# EAGLE schematic Flasher (EAGLE 7.6.0)
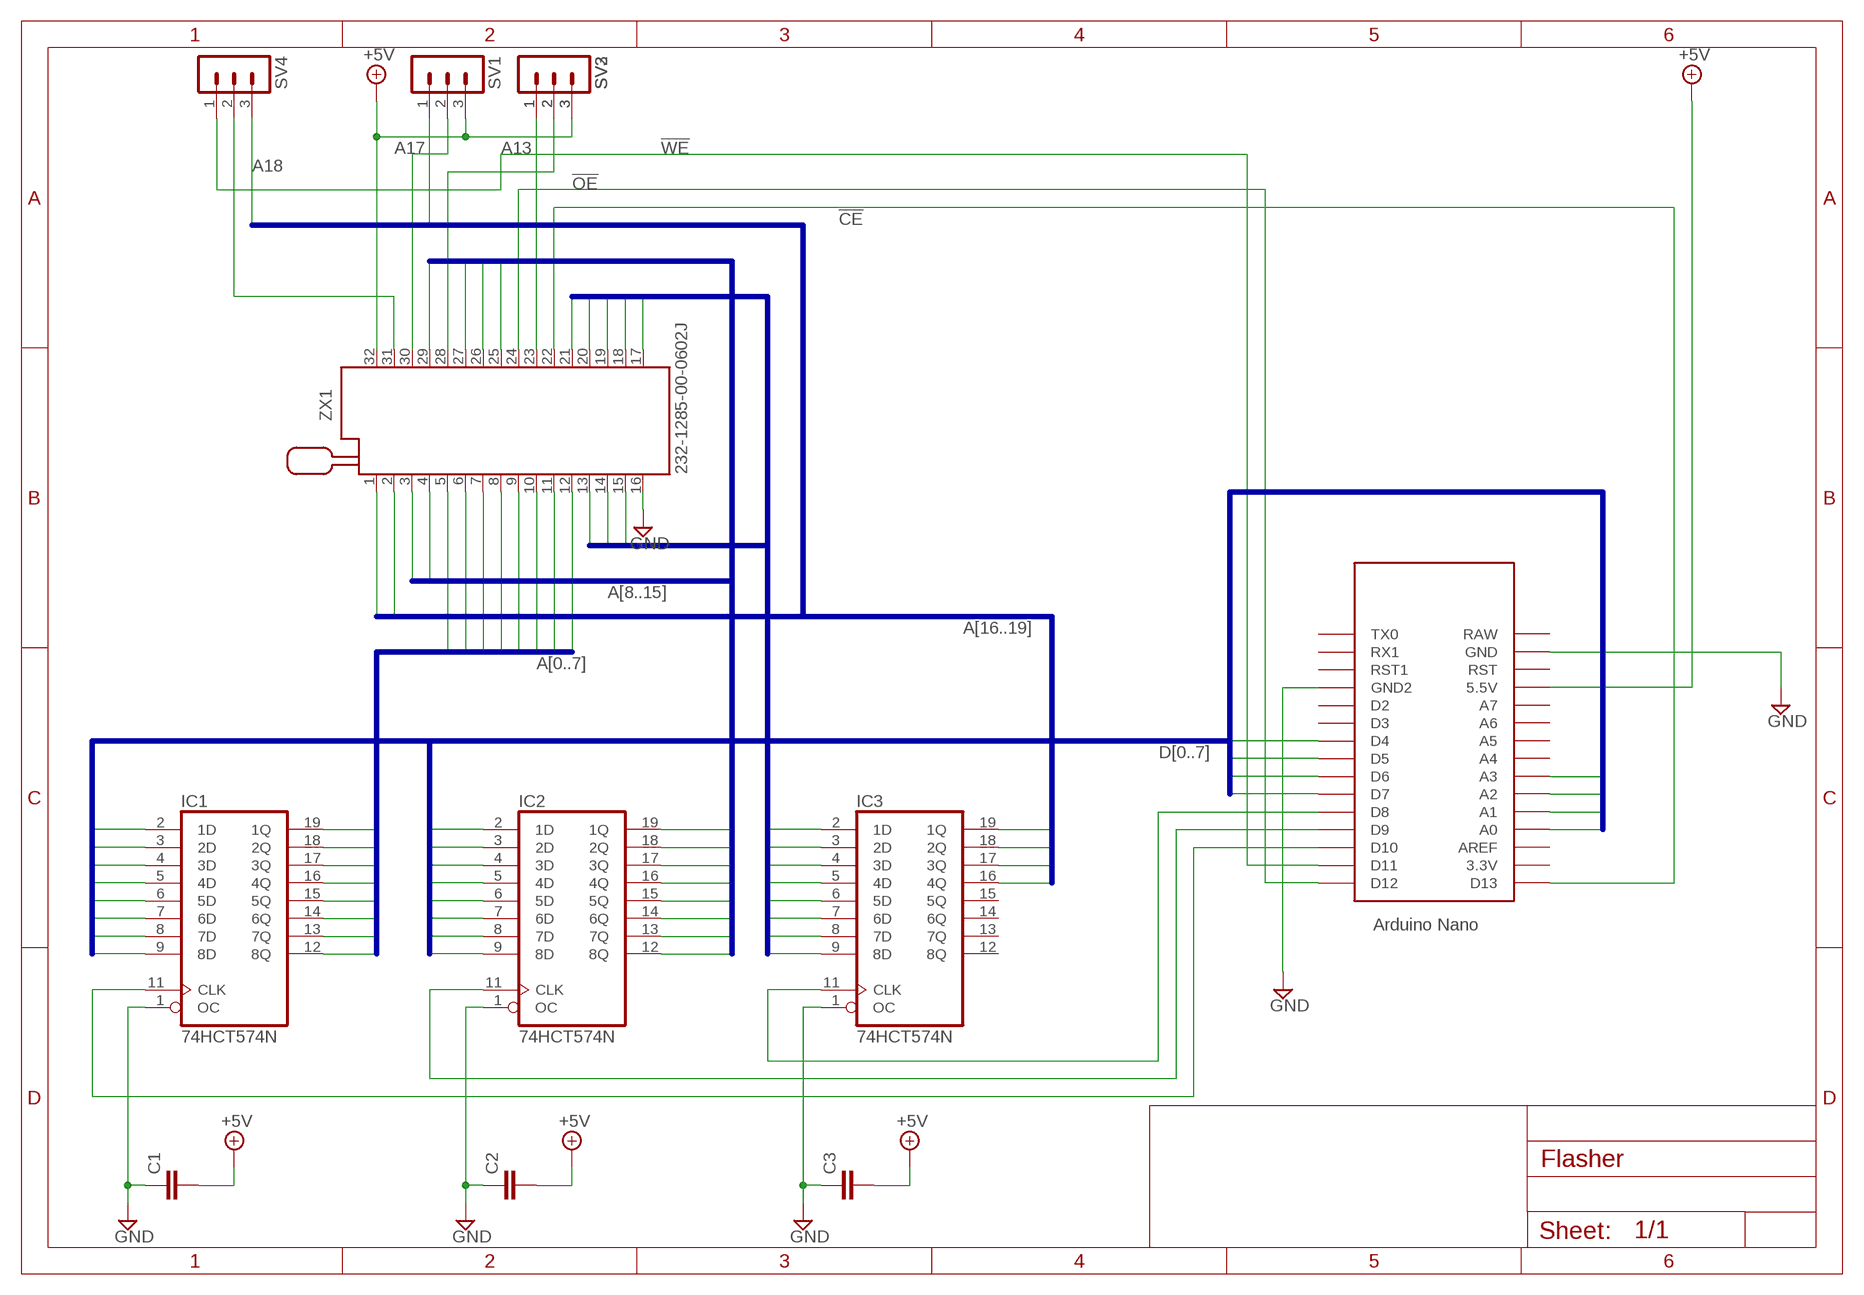
[diagram p0: schematic, sheet 1]

## Parts
C1  C-EU025-024X044  [C025-024X044]
C2  C-EU025-024X044  [C025-024X044]
C3  C-EU025-024X044  [C025-024X044]
IC1  74HCT574N  [DIL20]
IC2  74HCT574N  [DIL20]
IC3  74HCT574N  [DIL20]
SV1  MA03-1  [MA03-1]
SV2  MA03-1  [MA03-1]
SV3  MA03-1  [MA03-1]
SV4  MA03-1  [MA03-1]
U$1  NANO  [NANO]
ZX1  232-1285-00-0602J  [232-1285-00-0602J]

## Nets
!CE: U$1.D13 ZX1.22
!OE: U$1.D12 ZX1.24
!WE: SV4.1 U$1.D11
+5V: C1.2 C2.2 C3.2 SV1.3 SV2.3 SV3.3 U$1.5V(5.5V) ZX1.32
A0: IC1.19(1Q) ZX1.12
A1: IC1.18(2Q) ZX1.11
A2: IC1.17(3Q) ZX1.10
A3: IC1.16(4Q) ZX1.9
A4: IC1.15(5Q) ZX1.8
A5: IC1.14(6Q) ZX1.7
A6: IC1.13(7Q) ZX1.6
A7: IC1.12(8Q) ZX1.5
A8: IC2.19(1Q) ZX1.27
A9: IC2.18(2Q) ZX1.26
A10: IC2.17(3Q) ZX1.23
A11: IC2.16(4Q) ZX1.25
A12: IC2.15(5Q) ZX1.4
A13: IC2.14(6Q) SV2.1 SV3.1
A14: IC2.13(7Q) ZX1.29
A15: IC2.12(8Q) ZX1.3
A16: IC3.19(1Q) ZX1.2
A17: IC3.18(2Q) SV1.1
A18: IC3.17(3Q) SV4.3
A19: IC3.16(4Q) ZX1.1
D0: IC1.2(1D) IC2.2(1D) IC3.2(1D) U$1.A0 ZX1.13
D1: IC1.3(2D) IC2.3(2D) IC3.3(2D) U$1.A1 ZX1.14
D2: IC1.4(3D) IC2.4(3D) IC3.4(3D) U$1.A2 ZX1.15
D3: IC1.5(4D) IC2.5(4D) IC3.5(4D) U$1.A3 ZX1.17
D4: IC1.6(5D) IC2.6(5D) IC3.6(5D) U$1.D4 ZX1.18
D5: IC1.7(6D) IC2.7(6D) IC3.7(6D) U$1.D5 ZX1.19
D6: IC1.8(7D) IC2.8(7D) IC3.8(7D) U$1.D6 ZX1.20
D7: IC1.9(8D) IC2.9(8D) IC3.9(8D) U$1.D7 ZX1.21
GND: C1.1 C2.1 C3.1 IC1.1(OC) IC2.1(OC) IC3.1(OC) U$1.GND U$1.GND1(GND2) ZX1.16
N$1: IC1.11(CLK) U$1.D10
N$2: IC2.11(CLK) U$1.D9
N$3: IC3.11(CLK) U$1.D8
N$4: SV1.2 ZX1.30
N$5: SV2.2 SV3.2 ZX1.28
N$6: SV4.2 ZX1.31
Unconnected: IC3.12(8Q) IC3.13(7Q) IC3.14(6Q) IC3.15(5Q) U$1.3.3V U$1.A4 U$1.A5 U$1.A6 U$1.A7 U$1.AREF U$1.D2 U$1.D3 U$1.ICSP1 U$1.ICSP2 U$1.ICSP3 U$1.ICSP4 U$1.ICSP5 U$1.ICSP6 U$1.RAW U$1.RST U$1.RST1 U$1.RX1 U$1.TX0

## Buses
D[0..7]
A[0..7]
A[16..19]
A[8..15]

## Power pins joined to a net without a drawn wire
GND: IC1.10(GND) IC2.10(GND) IC3.10(GND)
VCC: IC1.20(VCC) IC2.20(VCC) IC3.20(VCC)

## Library data of the parts
C1-C3 = resistor:C-EU: CAPACITOR, European symbol
IC1-IC3 = 74xx-eu:74*574: 8-bit D type FLIP FLOP bus driver
SV1-SV4 = con-lstb:MA03-1: PIN HEADER; OC_FARNELL: unknown; OC_NEWARK: unknown
U$1 = Arduino-clone:NANO: Arduino Nano
ZX1 = con-3m:232-?: Zero Insertion Force Socked Source: http://www.3M.com/ehpd; MF: 3M; MPN: 232-1285-00-0602J; OC_FARNELL: 9897402; OC_NEWARK: 85K7839